# EAGLE schematic dcdc_mc34063_up_5to12 (EAGLE 6.4)
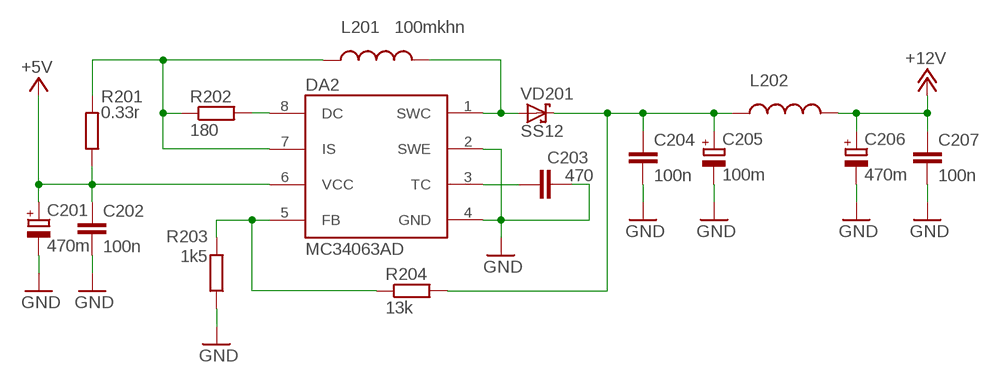
[diagram p0: schematic, sheet 1]

## Parts
C201  470m  CPOL-EUE3.5-8  [E3,5-8]
C202  100n  C-EUC0805  [C0805]
C203  470  C-EUC0805  [C0805]
C204  100n  C-EUC0805  [C0805]
C205  100m  CPOL-EUE2.5-5  [E2,5-5]
C206  470m  CPOL-EUE3.5-8  [E3,5-8]
C207  100n  C-EUC0805  [C0805]
DA2  MC34063AD  [SOIC8]
L201  100mkhn  L-USTFI0305  [TFI0305]
L202  L-US0204/7  [0204/7]
R201  0.33r  R-EU_M1206  [M1206]
R202  180  R-EU_M0805  [M0805]
R203  1k5  R-EU_M0805  [M0805]
R204  13k  R-EU_M0805  [M0805]
VD201  SS12  SCHOTTKY-DIODESMD  [SMB]

## Nets
+5V: C201.+ C202.1 DA2.6(VCC) R201.1
+12V: C206.+ C207.1 L202.2
GND: C201.- C202.2 C203.2 C204.2 C205.- C206.- C207.2 DA2.2(SWE) DA2.4(GND) R203.1
N$1: DA2.8(DC) R202.2
N$2: DA2.7(IS) L201.1 R201.2 R202.1
N$3: DA2.1(SWC) L201.2 VD201.A
N$4: C203.1 DA2.3(TC)
N$5: C204.1 C205.+ L202.1 R204.2 VD201.C
N$7: DA2.5(FB) R203.2 R204.1

## Library data of the parts
C201 C205 C206 = rcl:CPOL-EU: POLARIZED CAPACITOR, European symbol
C202-C204 C207 = rcl:C-EU: CAPACITOR, European symbol
DA2 = mc34063-2:MC34063
L201 L202 = rcl:L-US: INDUCTOR, American symbol
R201-R204 = rcl:R-EU_: RESISTOR, European symbol
VD201 = diode:SCHOTTKY-DIODE: Schottky Diode